# Altium schematic sheet SEP00949BG.SCHDOC
size A3
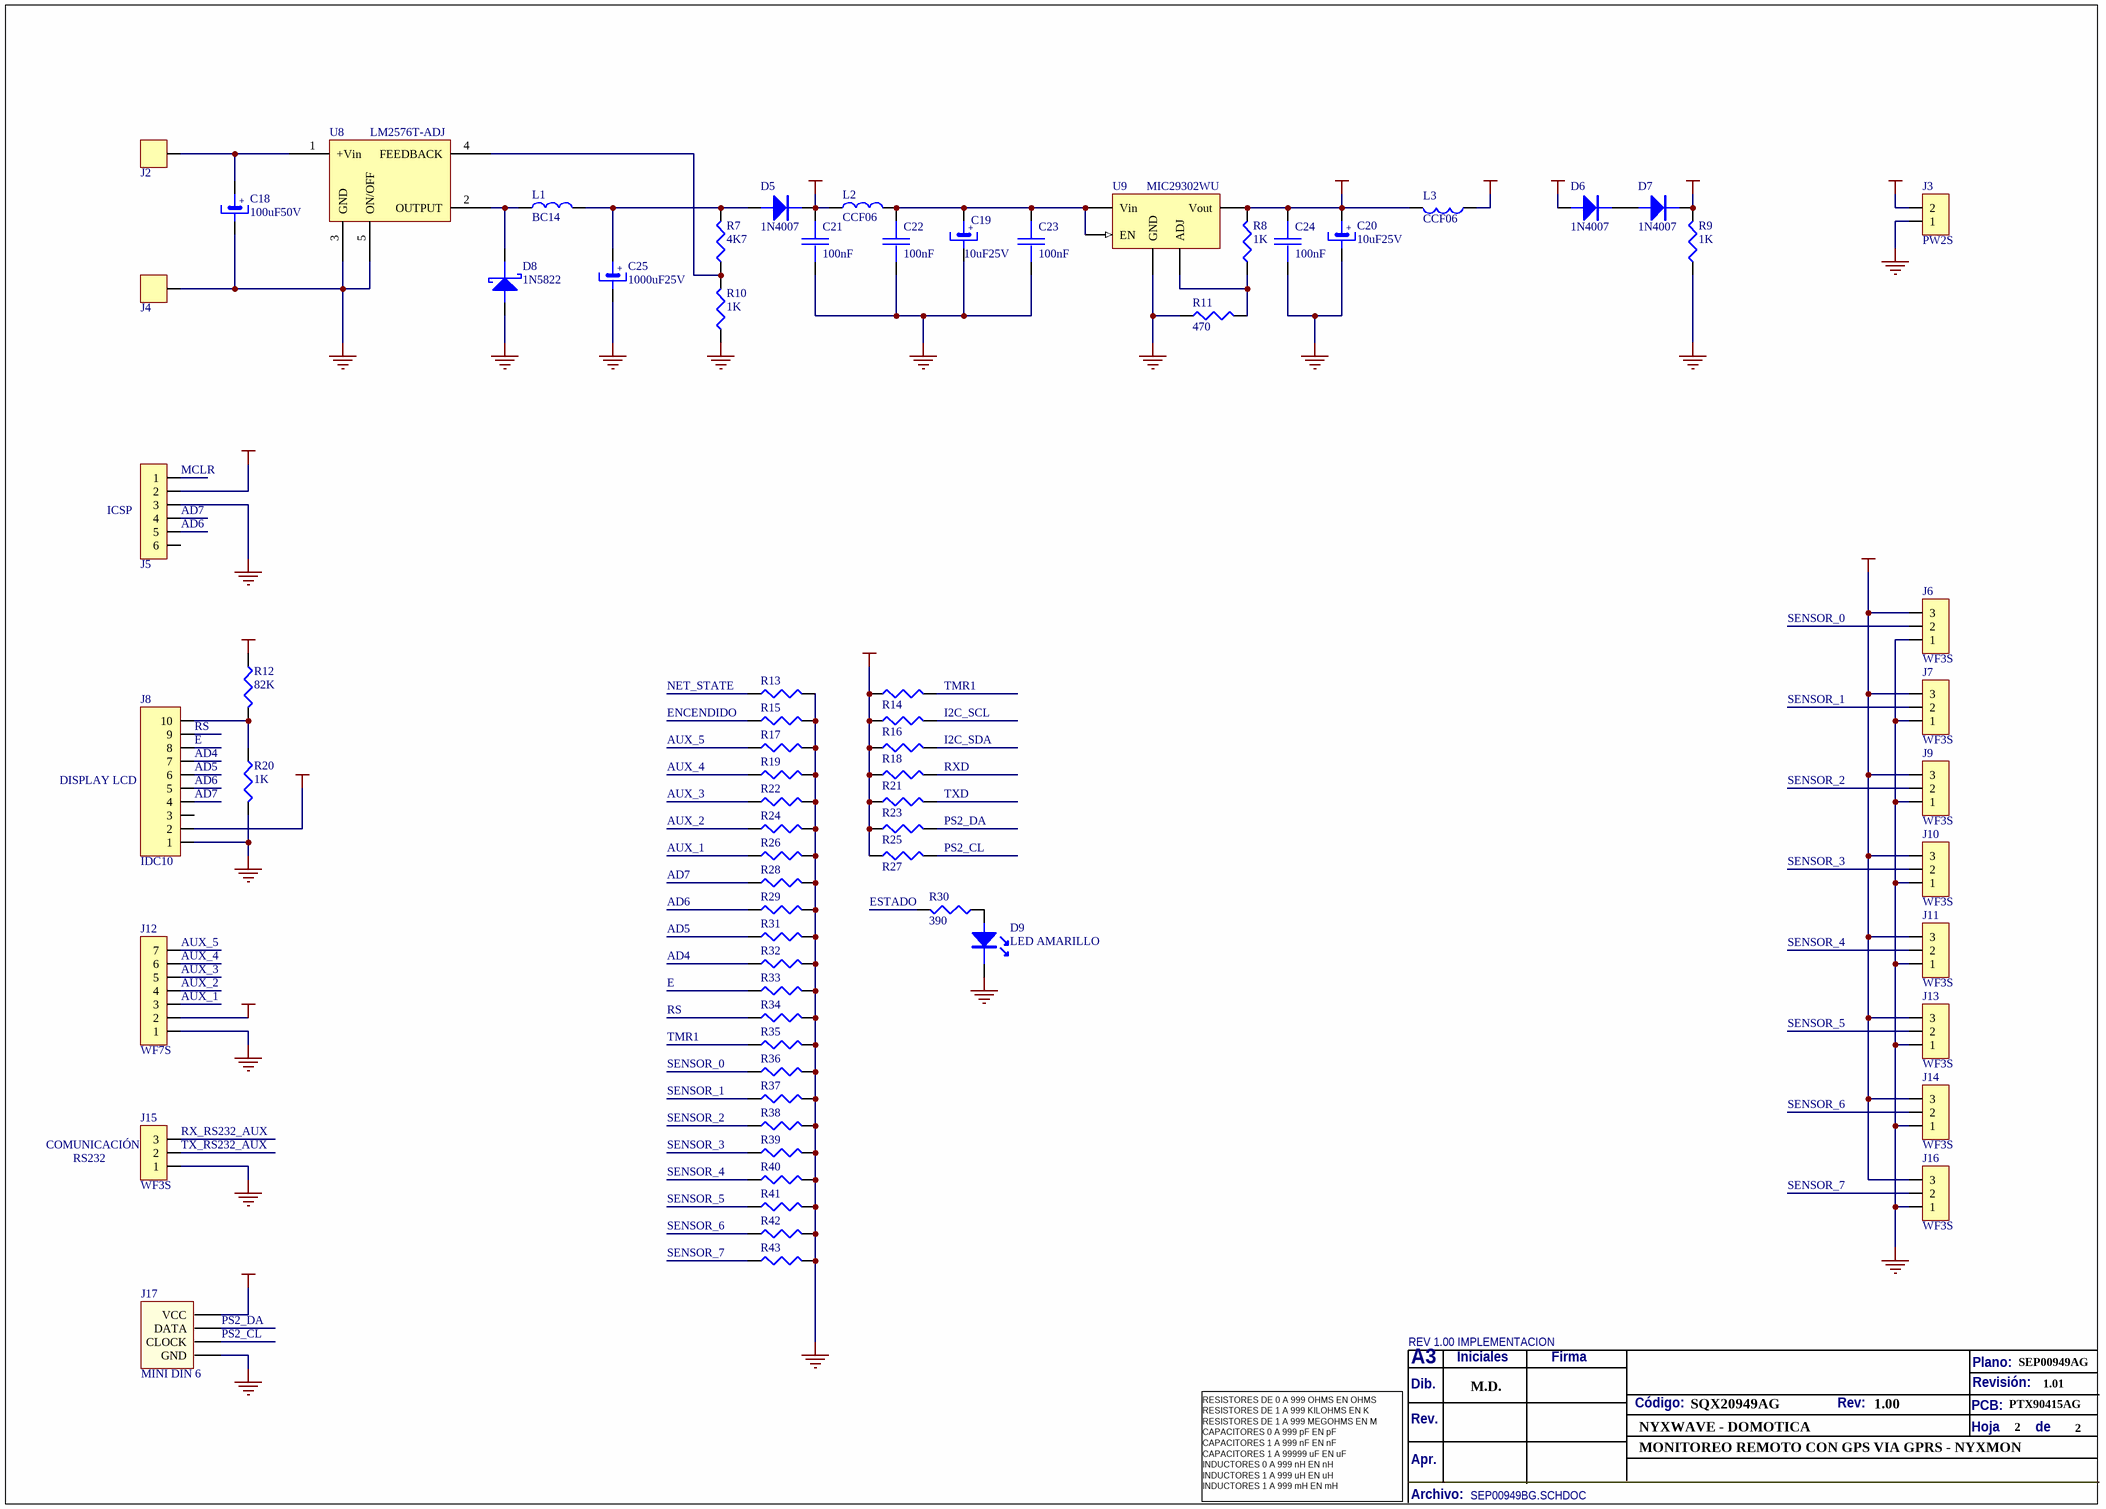
[diagram p0: SEP00949BG.SCHDOC]

## Parts
C18  100uF50V  [CE 5.0/10.0]
C19  10uF25V  [CE 1.5/4.0]
C20  10uF25V  [CE 1.5/4.0]
C21  100nF  [0805]
C22  100nF  [0805]
C23  100nF  [0805]
C24  100nF  [0805]
C25  1000uF25V  [CE 5.0/10.0]
D5  1N4007  [DO-41_300]
D6  1N4007  [DO-41_300]
D7  1N4007  [DO-41_300]
D8  1N5822  [DO-201_300]
D9  LED AMARILLO  [LED 3MM]
J2  WAGO236  [wago236]  (value not drawn)
J3  PW2S  [PW2S]
J4  WAGO236  [wago236]  (value not drawn)
J5  HEADER6  [JUMPER_6A]  (value not drawn)
J6  WF3S  [WF3S]
J7  WF3S  [WF3S]
J8  IDC10  [IDC10]
J9  WF3S  [WF3S]
J10  WF3S  [WF3S]
J11  WF3S  [WF3S]
J12  WF7S  [WF7S]
J13  WF3S  [WF3S]
J14  WF3S  [WF3S]
J15  WF3S  [WF3S]
J16  WF3S  [WF3S]
J17  MINI DIN 6  [MINI DIN PCB]
L1  BC14  [BCC]
L2  CCF06  [AXIAL10X4_300]
L3  CCF06  [AXIAL10X4_300]
R7  4K7  [RES_MF1/2W_200]
R8  1K  [RES_MF1/2W_200]
R9  1K  [RES_MF1/2W_200]
R10  1K  [RES_MF1/2W_200]
R11  470  [RES_MF1/2W_200]
R12  82K  [RES_MF1/2W_200]
R13  5K6  [0805]  (value not drawn)
R14  5K6  [0805]  (value not drawn)
R15  5K6  [0805]  (value not drawn)
R16  10K  [0805]  (value not drawn)
R17  5K6  [0805]  (value not drawn)
R18  10K  [0805]  (value not drawn)
R19  5K6  [0805]  (value not drawn)
R20  1K  [RES_MF1/2W_200]
R21  100K  [0805]  (value not drawn)
R22  5K6  [0805]  (value not drawn)
R23  100K  [0805]  (value not drawn)
R24  5K6  [0805]  (value not drawn)
R25  5K6  [0805]  (value not drawn)
R26  5K6  [0805]  (value not drawn)
R27  5K6  [0805]  (value not drawn)
R28  5K6  [0805]  (value not drawn)
R29  5K6  [0805]  (value not drawn)
R30  390  [RES_MF1/2W_200]
R31  5K6  [0805]  (value not drawn)
R32  5K6  [0805]  (value not drawn)
R33  5K6  [0805]  (value not drawn)
R34  5K6  [0805]  (value not drawn)
R35  5K6  [0805]  (value not drawn)
R36  150K  [0805]  (value not drawn)
R37  150K  [0805]  (value not drawn)
R38  150K  [0805]  (value not drawn)
R39  150K  [0805]  (value not drawn)
R40  150K  [0805]  (value not drawn)
R41  150K  [0805]  (value not drawn)
R42  150K  [0805]  (value not drawn)
R43  150K  [0805]  (value not drawn)
U8  LM2576T-ADJ  [TO-220-5V]
U9  MIC29302WU  [TO-220-5S]

## Nets
+5V: C20.1 C24.2 D6.A J6.3 J7.3 J8.2 J9.3 J10.3 J11.3 J12.2 J13.3 J14.3 J16.3 J17.4(VCC) L3.2 R8.2 R12.2 R14.2 R16.2 R18.2 R21.2 R23.2 R25.2 R27.2 U9.4(Vout)
+7V: C21.2 D5.K J3.2 L2.1
GND: C18.2 C19.2 C20.2 C21.1 C22.1 C23.1 C24.1 C25.2 D8.A D9.K J3.1 J4.1 J5.3 J6.1 J7.1 J8.1 J9.1 J10.1 J11.1 J12.1 J13.1 J14.1 J15.1 J16.1 J17.3(GND) R9.1 R10.1 R11.1 R13.2 R15.2 R17.2 R19.2 R20.1 R22.2 R24.2 R26.2 R28.2 R29.2 R31.2 R32.2 R33.2 R34.2 R35.2 R36.2 R37.2 R38.2 R39.2 R40.2 R41.2 R42.2 R43.2 U8.3(GND) U8.5(ON/OFF) U9.3(GND)
VBAT: D7.K R9.2
VDD: J5.2 L3.1
AD4: J8.7 R32.1
AD5: J8.6 R31.1
AD6: J5.5 J8.5 R29.1
AD7: J5.4 J8.4 R28.1
AUX_1: J12.3 R26.1
AUX_2: J12.4 R24.1
AUX_3: J12.5 R22.1
AUX_4: J12.6 R19.1
AUX_5: J12.7 R17.1
E: J8.8 R33.1
ENCENDIDO: R15.1
ESTADO: R30.2
I2C_SCL: R16.1
I2C_SDA: R18.1
MCLR: J5.1
NET_STATE: R13.1
PS2_CL: J17.5(CLOCK) R27.1
PS2_DA: J17.1(DATA) R25.1
RS: J8.9 R34.1
RX_RS232_AUX: J15.3
RXD: R21.1
SENSOR_0: J6.2 R36.1
SENSOR_1: J7.2 R37.1
SENSOR_2: J9.2 R38.1
SENSOR_3: J10.2 R39.1
SENSOR_4: J11.2 R40.1
SENSOR_5: J13.2 R41.1
SENSOR_6: J14.2 R42.1
SENSOR_7: J16.2 R43.1
TMR1: R14.1 R35.1
TX_RS232_AUX: J15.2
TXD: R23.1
NetC18_1: C18.1 J2.1 U8.1(+Vin)
NetC19_1: C19.1 C22.2 C23.2 L2.2 U9.1(EN) U9.2(Vin)
NetC25_1: C25.1 D5.A L1.2 R7.2
NetD6_K: D6.K D7.A
NetD8_K: D8.K L1.1 U8.2(OUTPUT)
NetD9_A: D9.A R30.1
NetJ8_10: J8.10 R12.1 R20.2
NetR7_1: R7.1 R10.2 U8.4(FEEDBACK)
NetR8_1: R8.1 R11.2 U9.5(ADJ)

Not connected (* = marked no-connect by the designer): J5 6; J8 3

## Notes on the sheet
- (near J5) ICSP
- DISPLAY LCD
- (near J15) COMUNICACIÓN
- RS232
- Labels drawn without touching a wire or pin: 1.00, 1.01, 2, M.D., MONITOREO REMOTO CON GPS VIA GPRS - NYXMON, PTX90415AG, SEP00949AG, SQX20949AG
- REV 1.00 IMPLEMENTACION
- Dib.
- A3
- Iniciales
- Firma
- Plano:
- Revisión:
- Rev.
- Apr.
- Código:
- Rev:
- Hoja          de
- PCB:
- RESISTORES DE 0 A 999 OHMS EN OHMS
  RESISTORES DE 1 A 999 KILOHMS EN K
  RESISTORES DE 1 A 999 MEGOHMS EN M
  CAPACITORES 0 A 999 pF EN pF
  CAPACITORES 1 A 999 nF EN nF
  CAPACITORES 1 A 99999 uF EN uF
  INDUCTORES 0 A 999 nH EN nH
  INDUCTORES 1 A 999 uH EN uH
  INDUCTORES 1 A 999 mH EN mH
- Archivo:
- (in symbol 10uF25V 4X7X1.5) +
- (in symbol 100uF50V) +
- (in symbol 1000uF25V) +

## Library data of the parts
C18 = 100uF50V: CAPACITOR ELECTROLITICO RADIAL 10 X12 mm PASO 5 mm 50 V 100 uF; CODIGO: YEAK107GBG
C19 C20 = 10uF25V 4X7X1.5: CAPACITOR ELECTROLITICO RADIAL 5X7mm PASO 1.5mm 85ªC +/-20 25V 10uF; CODIGO: YEAC106EBG
C21-C24 = 100n: CAPACITOR SMD 0805 X7R  50 V 100 nF; CODIGO: YSBC104AAG
C25 = 1000uF25V: CAP ELECT RAD 1000UF 25V 10X20MM PASO 5MM 85ºC 20%; CODIGO: YEDH108EBG
D5-D7 = 1N4007 DO-41: 1N4007 DO-41 DIODO; CODIGO: DR00001AAH
D8 = 1N5822 DO-201: 1N5822 DO-201 DIODO; CODIGO: DSN5822ACG
D9 = LED AMARILLO 3MM: CODIGO: DLRA030XCG
J2 J4 = WAGO 236: WAGO 236-401 BORNE GRIS CLARO; CODIGO: JCWEPXP01G
J3 = PW2S: PW2S HEADER .156" RECTO 2 VIAS; CODIGO: JNXEISP02G
J5 = HEADER6: TIRA MOLEX 1X6 11MM MACHO RECTA PARA PCB
J6 J7 J9-J11 J13-J16 = WF3S: WF3S HEADER .100" RECTO 3 VIAS; CODIGO: JCXGASP03G
J8 = IDC10: CONECTOR IDC HEMBRA PCB NO POLARIZADO PASO 2.54 mm RECTO 2X5 VIAS; CODIGO: JNXJDSP10G
J12 = WF7S: WF7S HEADER .100" RECTO 7 VIAS; CODIGO: JCXGASP07G
J17 = CONECTOR MINI DIN 6: CONECTOR MINI DIN 6 PARA PCB; CODIGO: XXX00000xx
L1 = BC14: INDUCTOR BC14
L2 = CCF06: INDUCTOR CCF06; CODIGO: LC0000003G
L3 = CCF06: INDUCTOR CCF06; CODIGO: LV0000003G
R7 = 4K7: RESISTOR METAL FILM 0.5 W 5% 4.7 KILOHMS; CODIGO: RMC00472EG
R8-R10 R20 = 1K: RESISTOR METAL FILM 0.5 W 5% 1 K OHMS; CODIGO: RMC00102EG
R11 = 470: RESISTOR METAL FILM 0.5 W 5% 470 OHMS; CODIGO: RMC00471EG
R12 = 82K: RESISTOR METAL FILM 0.5 W 5% 82 KILOHMS; CODIGO: RMC00823EG
R13-R15 R17 R19 R22 R24-R29 R31-R35 = 5K6: RESISTOR SMD0805 0.125 W 5%  5.6 K OHMS; CODIGO: RSB00562EG
R16 R18 = 10K: RESISTOR SMD0805 0.125 W 5%  10 K OHMS; CODIGO: RSB00103EG
R21 R23 = 100K: RESISTOR SMD0805 0.125 W 5%  100 K OHMS; CODIGO: RSB00104EG
R30 = 390: RESISTOR METAL FILM 0.5 W 5% 390 OHMS; CODIGO: RMC00391EG
R36-R43 = 150K: RESISTOR SMD0805 0.125 W 5%  150 K OHMS; CODIGO: RSB00154EG
U8 = LM2576T-ADJ: LM2576T-ADJ TO-220-5 CIRC INT; CODIGO: UV00031EFH
U9 = MIC29302WU: MIC29302WU TO-220 (T) HIGH CURRENT LOW DROPOUT REGULATORS; CODIGO: XXXXXXXXX1